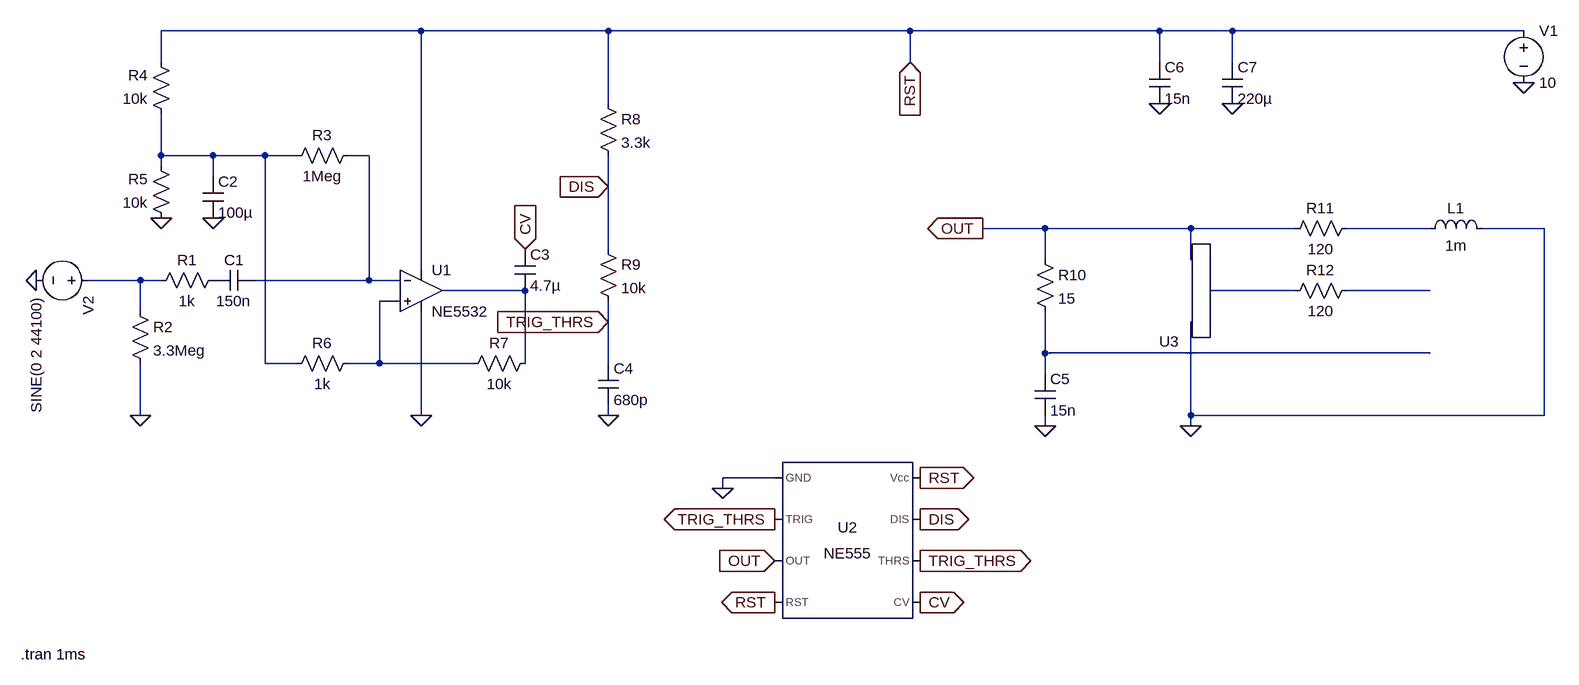
[diagram p0: schematic amplifier D_2.asc]
amplifier D_2.asc, the LTspice schematic file:
Version 4
SHEET 1 1896 752
WIRE 144 -224 -256 -224
WIRE 432 -224 144 -224
WIRE 896 -224 432 -224
WIRE 1280 -224 896 -224
WIRE 1392 -224 1280 -224
WIRE 1840 -224 1392 -224
WIRE -256 -176 -256 -224
WIRE 896 -176 896 -224
WIRE 1280 -176 1280 -224
WIRE 1392 -176 1392 -224
WIRE 432 -112 432 -224
WIRE -256 -32 -256 -96
WIRE -176 -32 -256 -32
WIRE -96 -32 -176 -32
WIRE -48 -32 -96 -32
WIRE 64 -32 32 -32
WIRE -256 -16 -256 -32
WIRE -176 0 -176 -32
WIRE 432 16 432 -32
WIRE 1104 80 1008 80
WIRE 1328 80 1104 80
WIRE 1488 80 1328 80
WIRE 1696 80 1568 80
WIRE 1872 80 1776 80
WIRE 432 112 432 16
WIRE 1104 128 1104 80
WIRE 1328 128 1328 80
WIRE 144 144 144 -224
WIRE -288 160 -368 160
WIRE -256 160 -288 160
WIRE 64 160 64 -32
WIRE 64 160 -112 160
WIRE 112 160 64 160
WIRE 304 176 176 176
WIRE 1488 176 1360 176
WIRE 1696 176 1568 176
WIRE 112 192 80 192
WIRE -288 208 -288 160
WIRE 432 224 432 192
WIRE 1104 272 1104 208
WIRE 1696 272 1104 272
WIRE -96 288 -96 -32
WIRE -48 288 -96 288
WIRE 80 288 80 192
WIRE 80 288 32 288
WIRE 224 288 80 288
WIRE 304 288 304 176
WIRE 432 288 432 224
WIRE 1104 304 1104 272
WIRE -288 368 -288 288
WIRE 144 368 144 208
WIRE 432 368 432 352
WIRE 1328 368 1328 224
WIRE 1872 368 1872 80
WIRE 1872 368 1328 368
WIRE 1104 384 1104 368
WIRE 1328 384 1328 368
WIRE 688 464 608 464
WIRE 608 480 608 464
FLAG -288 368 0
FLAG -256 64 0
FLAG -176 64 0
FLAG 144 368 0
FLAG 304 112 CV
IOPIN 304 112 In
FLAG 912 656 CV
IOPIN 912 656 Out
FLAG 432 368 0
FLAG 432 224 TRIG_THRS
IOPIN 432 224 In
FLAG 688 528 TRIG_THRS
IOPIN 688 528 Out
FLAG 912 592 TRIG_THRS
IOPIN 912 592 Out
FLAG 912 528 DIS
IOPIN 912 528 Out
FLAG 432 16 DIS
IOPIN 432 16 In
FLAG 896 -176 RST
IOPIN 896 -176 In
FLAG 688 656 RST
IOPIN 688 656 Out
FLAG 608 480 0
FLAG 912 464 RST
IOPIN 912 464 Out
FLAG 688 592 OUT
IOPIN 688 592 In
FLAG 1008 80 OUT
IOPIN 1008 80 Out
FLAG 1104 384 0
FLAG 1328 384 0
FLAG -448 160 0
FLAG 1840 -144 0
FLAG 1280 -112 0
FLAG 1392 -112 0
SYMBOL EXTRA\\AudioOpamp\\TI\\NE5532 144 176 R0
SYMATTR InstName U1
SYMBOL cap -112 144 R90
WINDOW 0 0 32 VBottom 2
WINDOW 3 32 32 VTop 2
SYMATTR InstName C1
SYMATTR Value 150n
SYMBOL res -160 144 R90
WINDOW 0 0 56 VBottom 2
WINDOW 3 32 56 VTop 2
SYMATTR InstName R1
SYMATTR Value 1k
SYMBOL res -304 192 R0
SYMATTR InstName R2
SYMATTR Value 3.3Meg
SYMBOL res 48 -48 R90
WINDOW 0 0 56 VBottom 2
WINDOW 3 32 56 VTop 2
SYMATTR InstName R3
SYMATTR Value 1Meg
SYMBOL res -240 -80 R180
WINDOW 0 36 76 Left 2
WINDOW 3 36 40 Left 2
SYMATTR InstName R4
SYMATTR Value 10k
SYMBOL res -240 80 R180
WINDOW 0 36 76 Left 2
WINDOW 3 36 40 Left 2
SYMATTR InstName R5
SYMATTR Value 10k
SYMBOL res -64 304 R270
WINDOW 0 32 56 VTop 2
WINDOW 3 0 56 VBottom 2
SYMATTR InstName R6
SYMATTR Value 1k
SYMBOL res 208 304 R270
WINDOW 0 32 56 VTop 2
WINDOW 3 0 56 VBottom 2
SYMATTR InstName R7
SYMATTR Value 10k
SYMBOL res 416 -128 R0
SYMATTR InstName R8
SYMATTR Value 3.3k
SYMBOL res 416 96 R0
SYMATTR InstName R9
SYMATTR Value 10k
SYMBOL res 1088 112 R0
SYMATTR InstName R10
SYMATTR Value 15
SYMBOL cap -192 0 R0
SYMATTR InstName C2
SYMATTR Value 100µ
SYMATTR SpiceLine V=16
SYMBOL Misc\\NE555 800 560 R0
SYMATTR InstName U2
SYMBOL cap 288 112 R0
SYMATTR InstName C3
SYMATTR Value 4.7µ
SYMBOL cap 416 288 R0
SYMATTR InstName C4
SYMATTR Value 680p
SYMBOL EXTRA\\Misc\\pot 1328 176 R180
SYMATTR InstName U3
SYMBOL cap 1088 304 R0
SYMATTR InstName C5
SYMATTR Value 15n
SYMBOL res 1584 64 R90
WINDOW 0 0 56 VBottom 2
WINDOW 3 32 56 VTop 2
SYMATTR InstName R11
SYMATTR Value 120
SYMBOL res 1584 160 R90
WINDOW 0 0 56 VBottom 2
WINDOW 3 32 56 VTop 2
SYMATTR InstName R12
SYMATTR Value 120
SYMBOL voltage 1840 -240 R0
WINDOW 123 0 0 Left 2
WINDOW 39 0 0 Left 2
SYMATTR InstName V1
SYMATTR Value 10
SYMBOL voltage -352 160 R90
WINDOW 123 0 0 Left 2
WINDOW 39 0 0 Left 2
SYMATTR InstName V2
SYMATTR Value SINE(0 2 44100)
SYMBOL cap 1264 -176 R0
SYMATTR InstName C6
SYMATTR Value 15n
SYMBOL cap 1376 -176 R0
SYMATTR InstName C7
SYMATTR Value 220µ
SYMATTR SpiceLine V=16
SYMBOL ind 1680 96 R270
WINDOW 0 32 56 VTop 2
WINDOW 3 5 56 VBottom 2
SYMATTR InstName L1
SYMATTR Value 1m
TEXT -472 736 Left 2 !.tran 1ms

The netlist it stands for:
* amplifier D_2.asc
XU1 N008 N002 RST 0 N005 NE5532  ; pins In+ In- V+ V- OUT
C1 N002 P001 150n
R1 P001 N004 1k
R2 N004 0 3.3Meg
R3 N002 N001 1Meg
R4 N001 RST 10k
R5 0 N001 10k
R6 N001 N008 1k
R7 N008 N005 10k
R8 RST DIS 3.3k
R9 DIS TRIG_THRS 10k
R10 OUT N009 15
C2 N001 0 100µ V=16
XU2 0 TRIG_THRS OUT RST CV TRIG_THRS DIS RST NE555  ; pins GND TRIG OUT RST CV THRS DIS Vcc
C3 CV N005 4.7µ
C4 TRIG_THRS 0 680p
XU3 0 OUT N006 pot
C5 N009 0 15n
R11 N003 OUT 120
R12 N007 N006 120
V1 RST 0 10
V2 N004 0 SINE(0 2 44100)
C6 RST 0 15n
C7 RST 0 220µ V=16
L1 N003 0 1m
.tran 1ms
.lib NE555.sub
.lib POT.lib
.backanno
.end